# EAGLE design 4Mot_Platine_2022_03 (EAGLE 9.6.2)
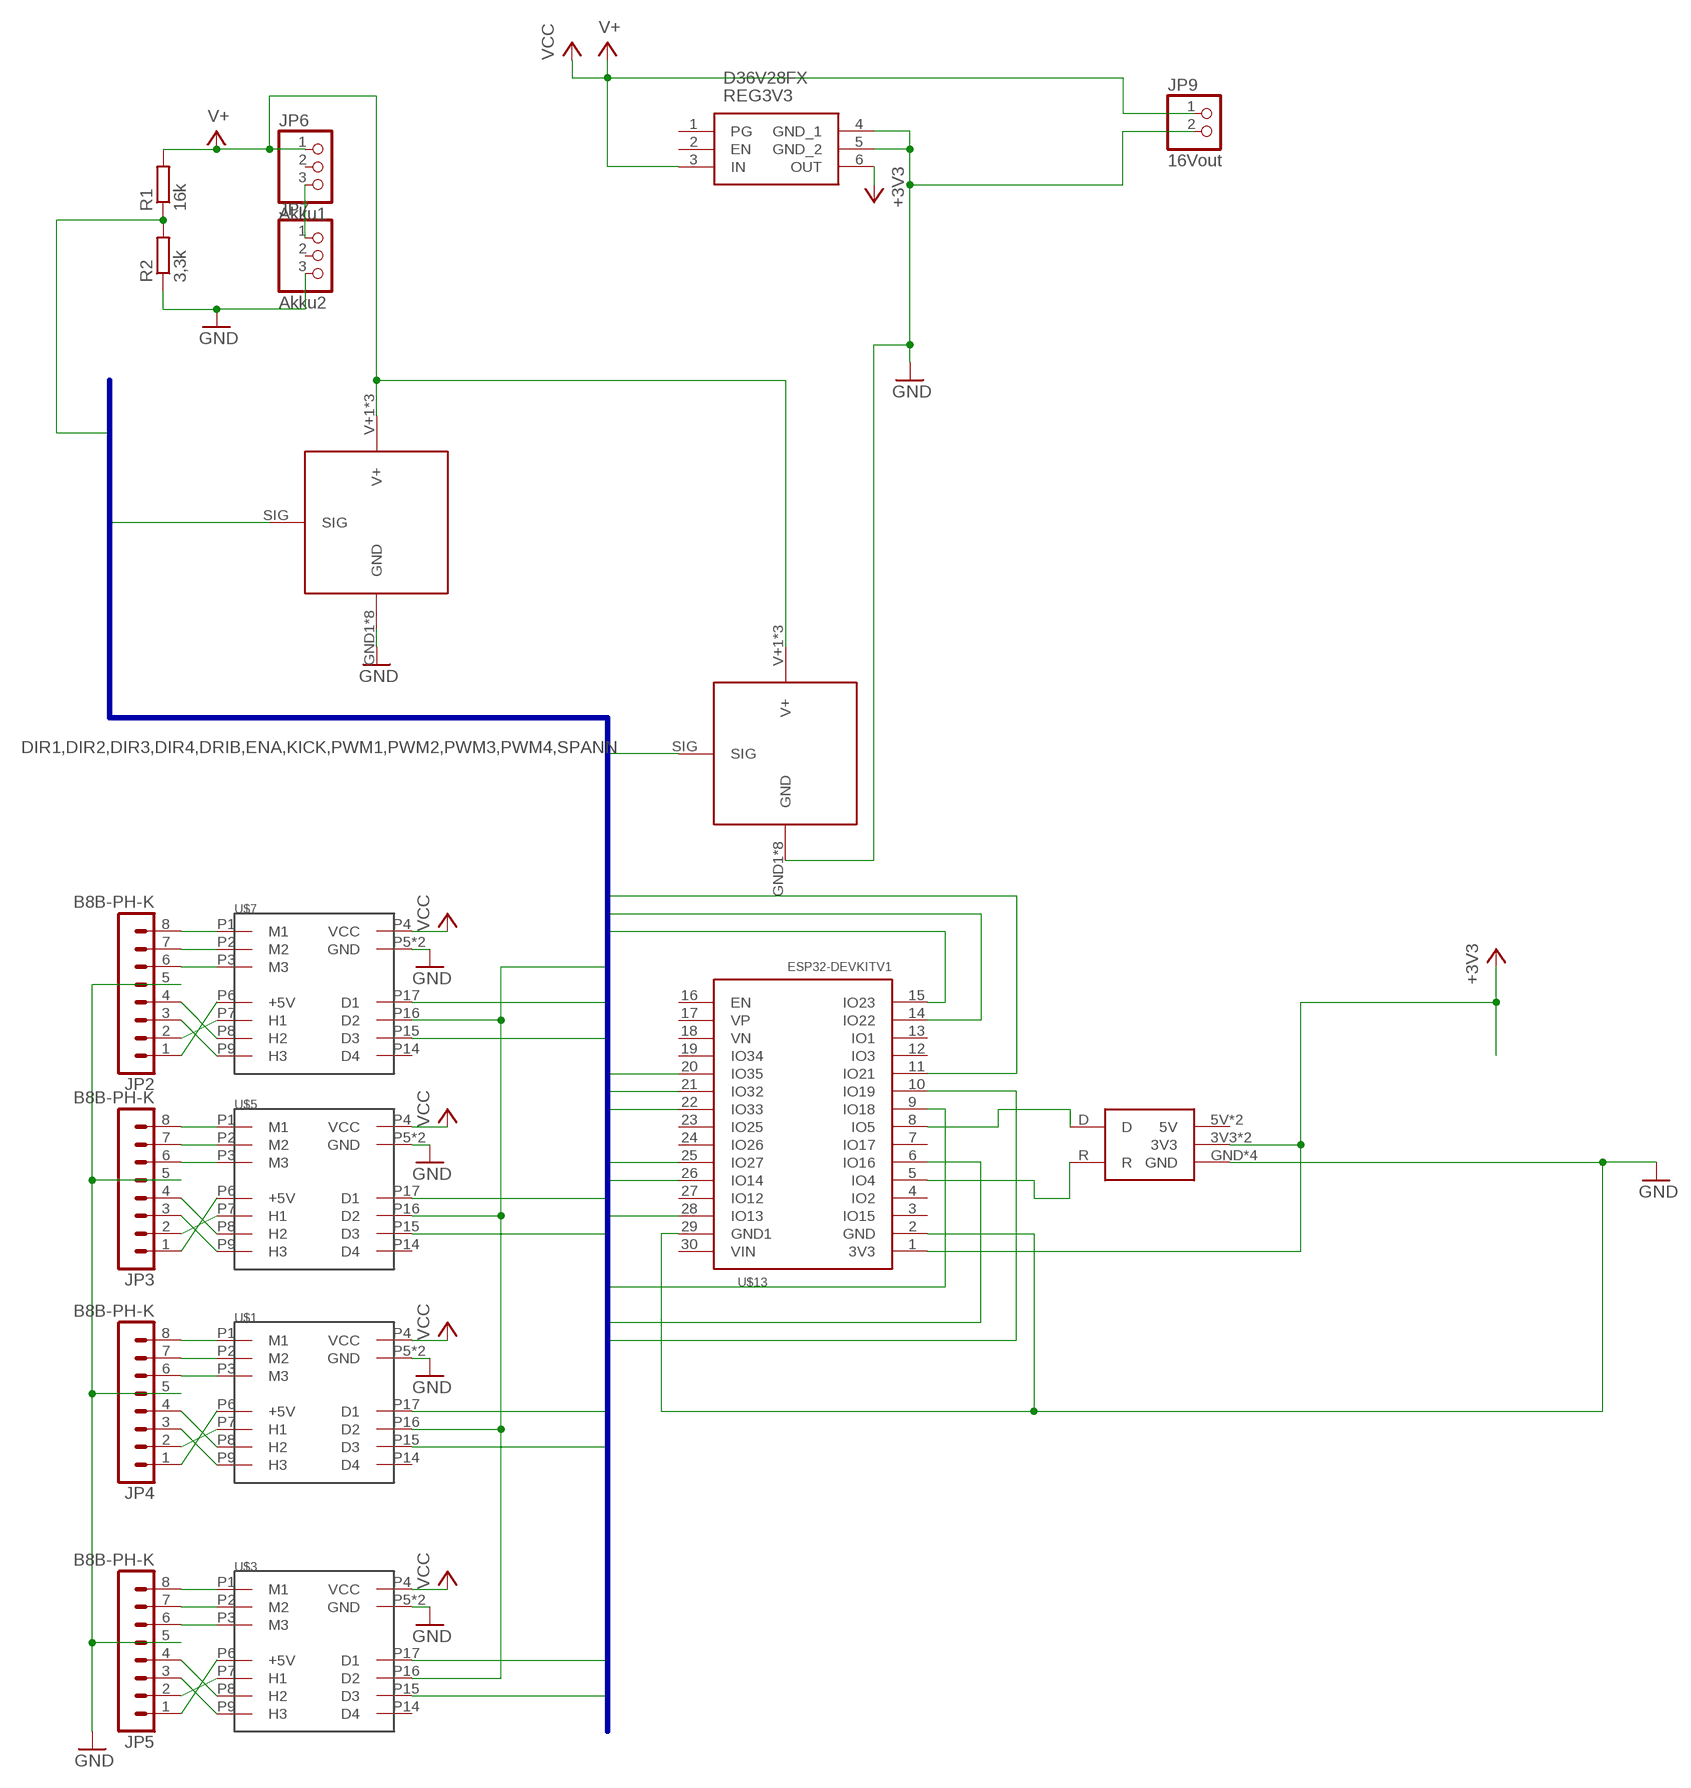
[diagram p0: schematic, sheet 1]

## Parts
JP2  B8B-PH-K  [B8B-PH-K]
JP3  B8B-PH-K  [B8B-PH-K]
JP4  B8B-PH-K  [B8B-PH-K]
JP5  B8B-PH-K  [B8B-PH-K]
JP6  Akku1  PINHD-1X3  [1X03]
JP7  Akku2  PINHD-1X3  [1X03]
JP9  16Vout  PINHD-1X2  [1X02]
R1  16k  R-EU_0204/7  [0204/7]
R2  3,3k  R-EU_0204/7  [0204/7]
REG3V3  D36V28FX  [D36V28FX]
U$1  24/2  [24/2]
U$3  24/2  [24/2]
U$5  24/2  [24/2]
U$7  24/2  [24/2]
U$13  ESP32DEVKITV1  [ESP32-DEVKITV1]
U$14  KICKER  [KICKER]
U$15  KICKER  [KICKER]
U$18  CANBUS  [CANBUS]

## Nets
+3V3: REG3V3.6(OUT) U$13.1(3V3) U$18.3V3 U$18.3V3_1(3V3)
D: U$13.8(IO5) U$18.D
DIR1: U$7.P15(D3) U$13.25(IO27)
DIR2: U$5.P15(D3) U$13.21(IO32)
DIR3: U$1.P15(D3) U$13.11(IO21)
DIR4: U$3.P15(D3) U$13.9(IO18)
DRIB: U$13.28(IO13) U$14.SIG
ENA: U$1.P16(D2) U$3.P16(D2) U$5.P16(D2) U$7.P16(D2) U$13.15(IO23)
GND: JP2.5 JP3.5 JP4.5 JP5.5 JP7.3 JP9.2 R2.1 REG3V3.4(GND_1) REG3V3.5(GND_2) U$1.P5(GND) U$1.P18(GND) U$3.P5(GND) U$3.P18(GND) U$5.P5(GND) U$5.P18(GND) U$7.P5(GND) U$7.P18(GND) U$13.2(GND) U$13.29(GND1) U$14.GND1(GND) U$14.GND2(GND) U$14.GND3(GND) U$14.GND4(GND) U$14.GND5(GND) U$14.GND6(GND) U$14.GND7(GND) U$14.GND8(GND) U$15.GND1(GND) U$15.GND2(GND) U$15.GND3(GND) U$15.GND4(GND) U$15.GND5(GND) U$15.GND6(GND) U$15.GND7(GND) U$15.GND8(GND) U$18.GND U$18.GND_1(GND) U$18.GND_2(GND) U$18.GND_3(GND)
KICK: U$13.6(IO16) U$15.SIG
N$2: JP6.3 JP7.1
N$7: JP2.8 U$7.P1(M1)
N$8: JP2.7 U$7.P2(M2)
N$9: JP2.6 U$7.P3(M3)
N$10: JP3.8 U$5.P1(M1)
N$11: JP3.7 U$5.P2(M2)
N$12: JP3.6 U$5.P3(M3)
N$13: JP4.8 U$1.P1(M1)
N$17: JP4.7 U$1.P2(M2)
N$18: JP4.6 U$1.P3(M3)
N$19: JP5.8 U$3.P1(M1)
N$20: JP5.7 U$3.P2(M2)
N$21: JP5.6 U$3.P3(M3)
N$22: JP2.2 U$7.P7(H1)
N$23: JP2.3 U$7.P9(H3)
N$24: JP2.4 U$7.P8(H2)
N$25: JP3.2 U$5.P7(H1)
N$26: JP3.3 U$5.P9(H3)
N$27: JP3.4 U$5.P8(H2)
N$28: JP4.2 U$1.P7(H1)
N$29: JP4.3 U$1.P9(H3)
N$30: JP4.4 U$1.P8(H2)
N$31: JP5.2 U$3.P7(H1)
N$32: JP5.3 U$3.P9(H3)
N$33: JP5.4 U$3.P8(H2)
N$34: JP2.1 U$7.P6(+5V)
N$35: JP3.1 U$5.P6(+5V)
N$36: JP4.1 U$1.P6(+5V)
N$37: JP5.1 U$3.P6(+5V)
PWM1: U$7.P17(D1) U$13.26(IO14)
PWM2: U$5.P17(D1) U$13.22(IO33)
PWM3: U$1.P17(D1) U$13.14(IO22)
PWM4: U$3.P17(D1) U$13.10(IO19)
R: U$13.5(IO4) U$18.R
SPANN: R1.1 R2.2 U$13.20(IO35)
V+: JP6.1 JP9.1 R1.2 REG3V3.3(IN) U$1.P4(VCC) U$3.P4(VCC) U$5.P4(VCC) U$7.P4(VCC) U$14.V+1(V+) U$14.V+2(V+) U$14.V+3(V+) U$15.V+1(V+) U$15.V+2(V+) U$15.V+3(V+) ; supply symbol labelled VCC
Unconnected: JP6.2 JP7.2 REG3V3.1(PG) REG3V3.2(EN) U$1.P14(D4) U$3.P14(D4) U$5.P14(D4) U$7.P14(D4) U$13.3(IO15) U$13.4(IO2) U$13.7(IO17) U$13.12(IO3) U$13.13(IO1) U$13.16(EN) U$13.17(VP) U$13.18(VN) U$13.19(IO34) U$13.23(IO25) U$13.24(IO26) U$13.27(IO12) U$13.30(VIN) U$18.5V U$18.5V_1(5V)

## Buses
DIR1,DIR2,DIR3,DIR4,DRIB,ENA,KICK,PWM1,PWM2,PWM3,PWM4,SPANN

## Library data of the parts
JP2-JP5 = con-jst-ph:B8B-PH-K: HEADER
JP6 JP7 = pinhead:PINHD-1X3: PIN HEADER
JP9 = pinhead:PINHD-1X2: PIN HEADER
R1 R2 = rcl:R-EU_: RESISTOR, European symbol
REG3V3 = D36V28FX:D36V28FX: 5V, 3.2A Step-Down Voltage Regulator D36V28F5 Source: Datasheet <https://www.pololu.com/product/3782>; DESCRIPTION: 5V, 3.2A Step-Down Voltage Regulator D36V28F5; HEIGHT: 8.77mm; MANUFACTURER_NAME: POLOLU ROBOTICS & ELECTRONICS; MANUFACTURER_PART_NUMBER: D36V28FX
U$1 U$3 U$5 U$7 = maxon-Regler:24/2
U$13 = ESP32-DEVKITV1:ESP32DEVKITV1
U$14 U$15 = kicker:KICKER
U$18 = canbus:CANBUS

## Board
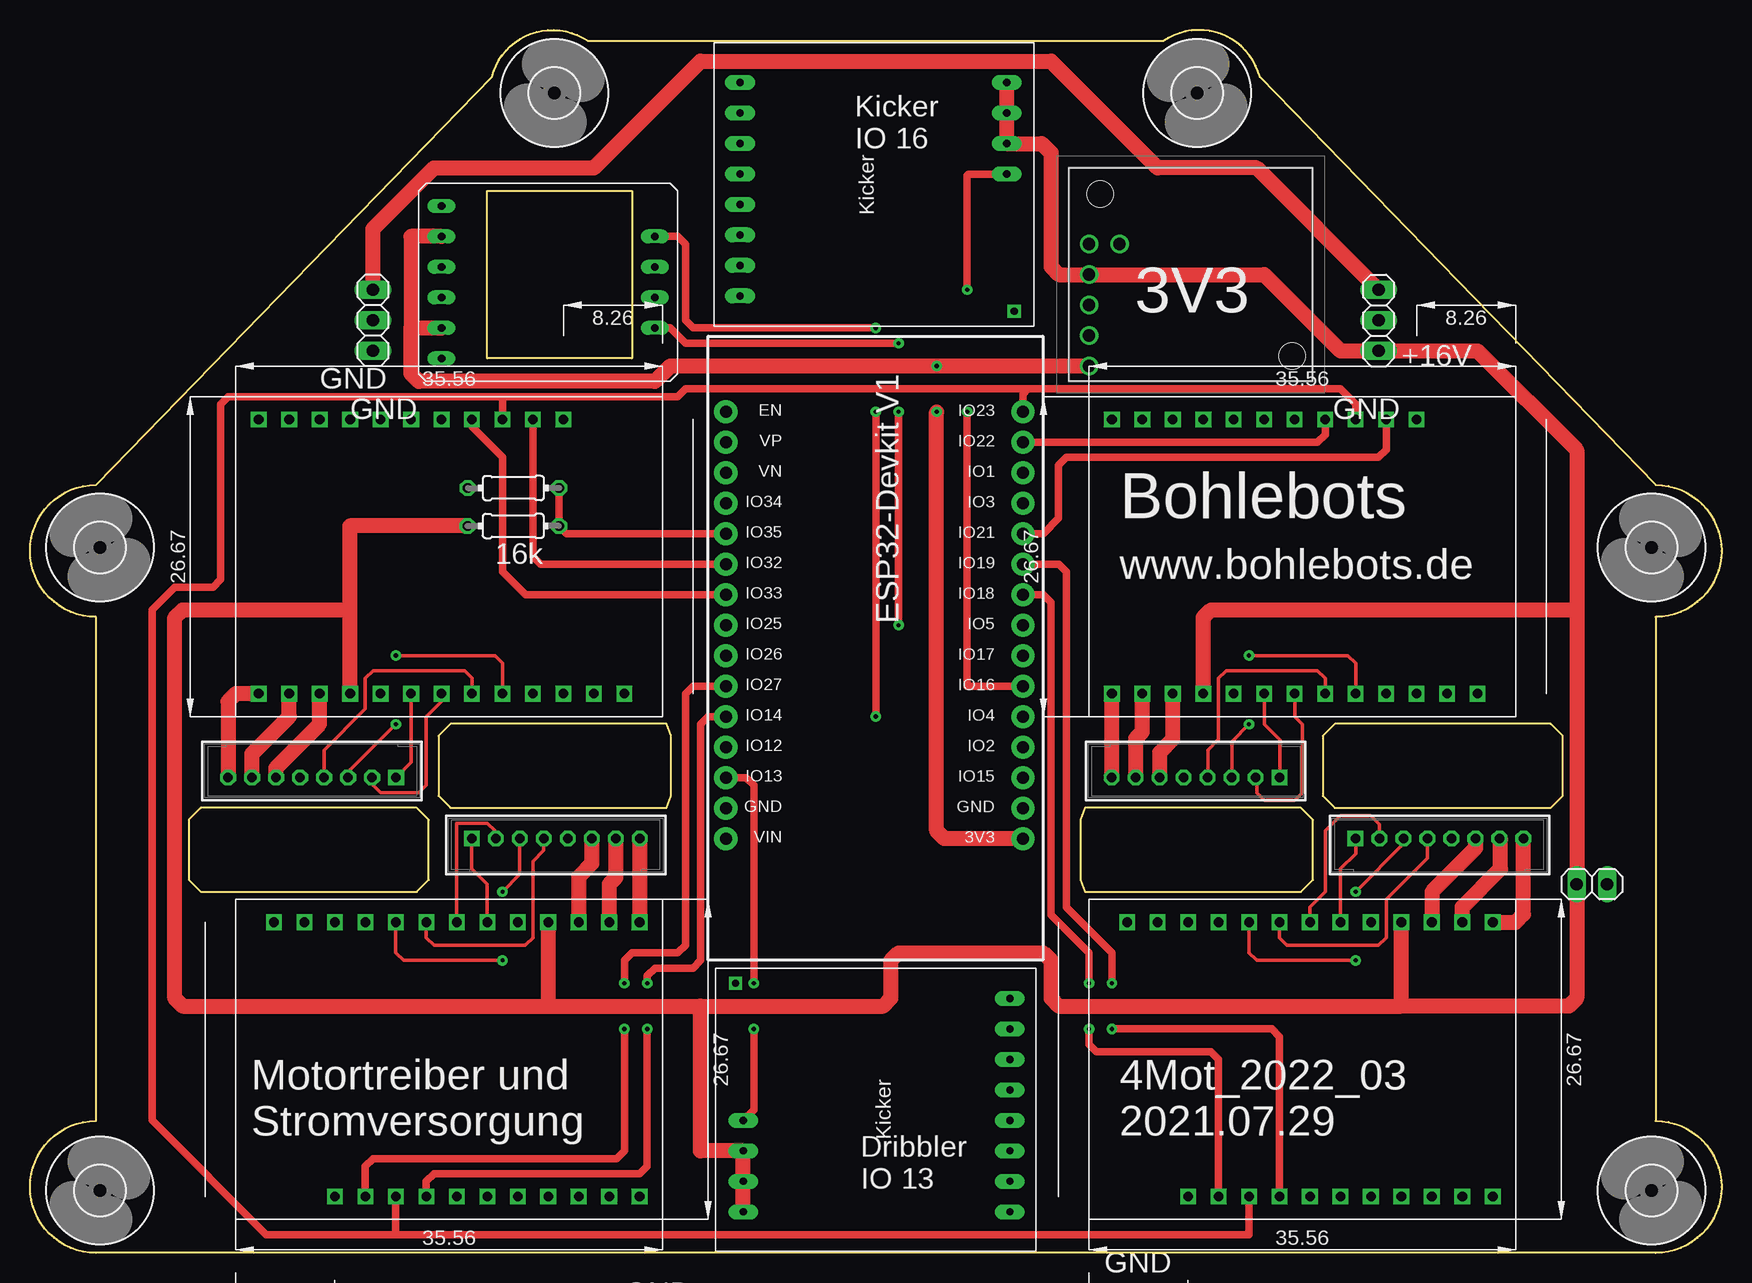
[diagram p1: board, top side]
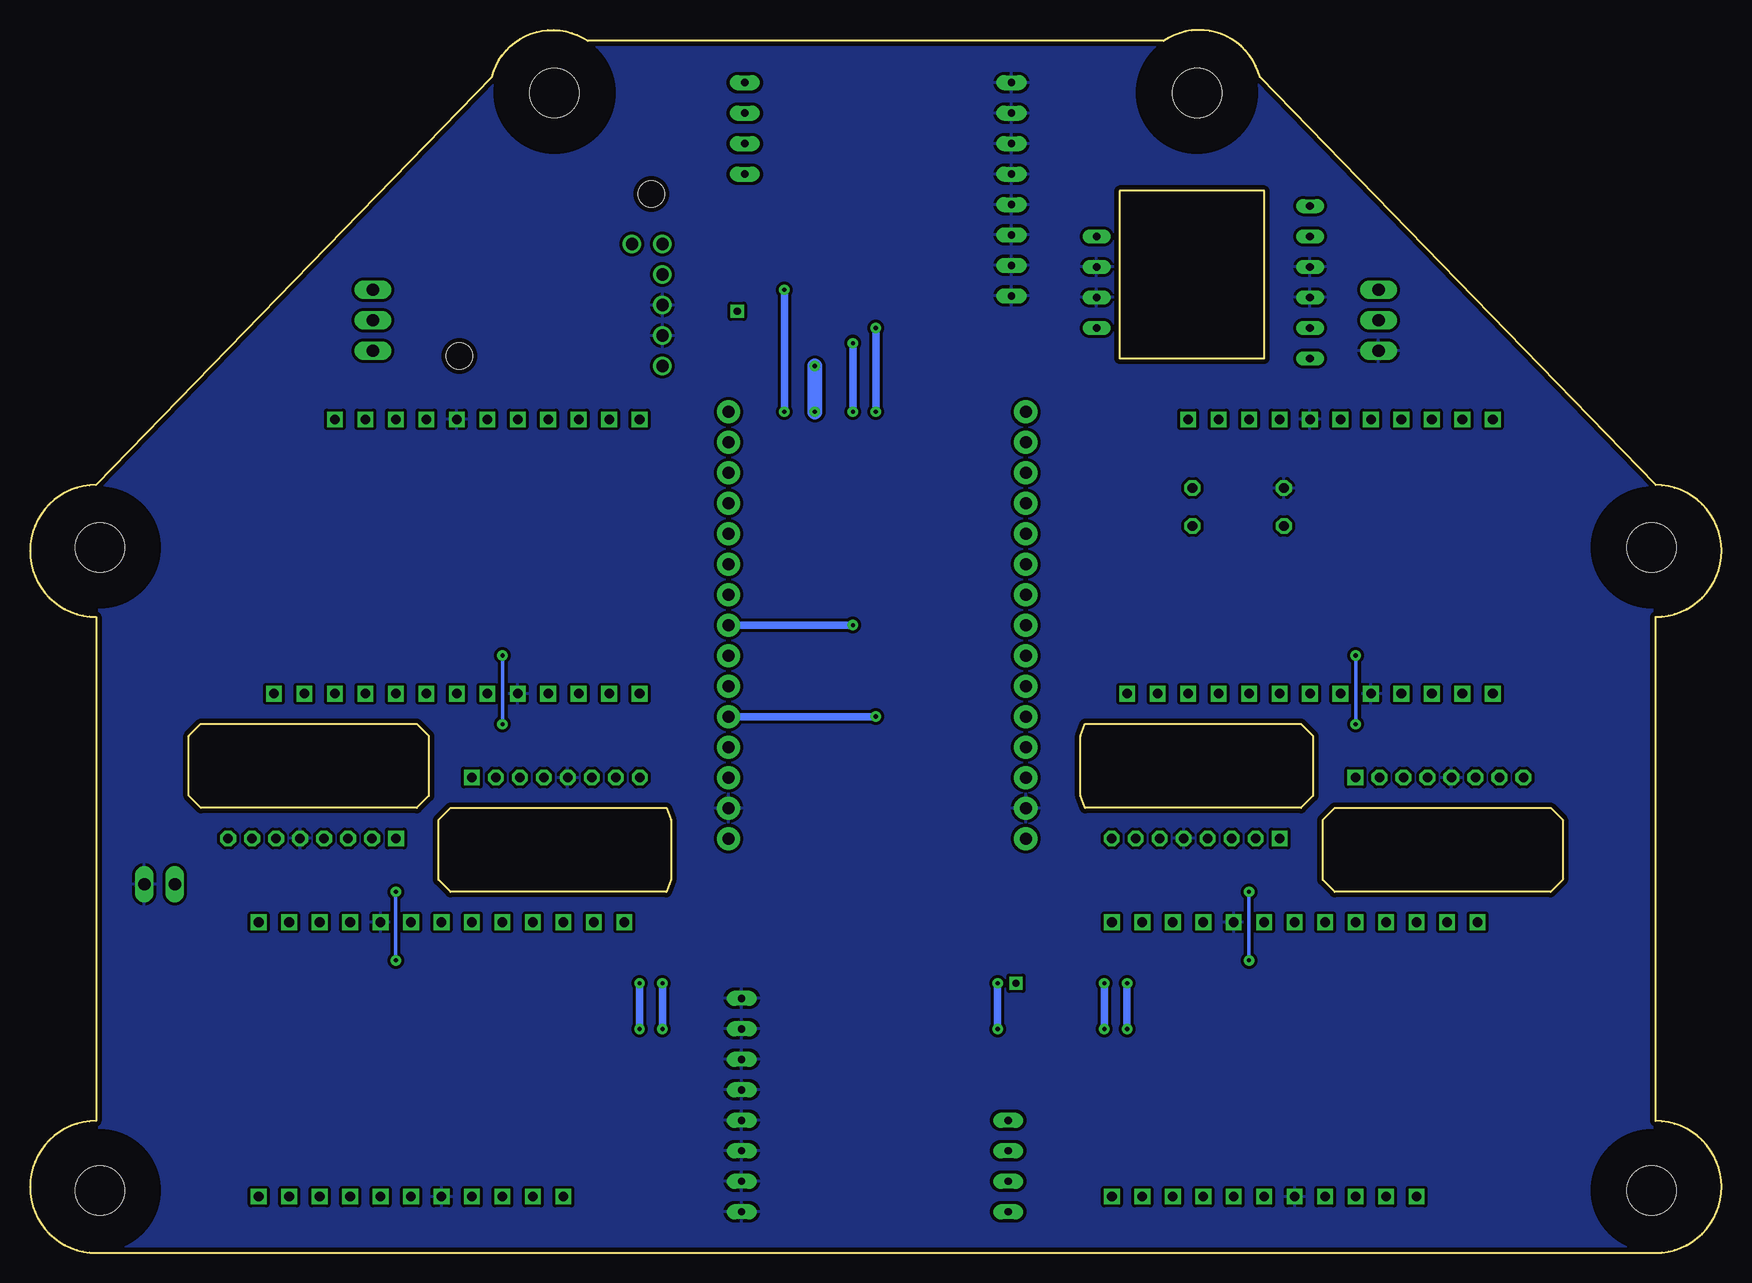
[diagram p2: board, bottom side, seen from below]

Size 141 x 101.91 mm. Coordinates in mm from the lower left corner, seen from the top.
Outline: 5.5,11 5.5,53 arc-180 5.5,64 38.5,98 arc-110 46.5,101 94.5,101 arc-110 102.5,98 135.5,64 arc-180 135.5,53 135.5,11 arc-180 135.5,0 5.5,0 arc-180 5.5,11
Outline: 108.77,37.08 126.77,37.08 127.77,38.08 127.77,43.08 126.77,44.08 108.77,44.08 107.77,43.08 107.77,38.08 108.77,37.08
Outline: 87.94,30.08 105.94,30.08 106.94,31.08 106.94,36.08 105.94,37.08 87.94,37.08 87.58,36.08 87.58,31.08 87.94,30.08
Outline: 35.05,37.08 53.05,37.08 53.42,38.08 53.42,43.08 53.05,44.08 35.05,44.08 34.05,43.08 34.05,38.08 35.05,37.08
Outline: 14.23,30.08 32.23,30.08 33.23,31.08 33.23,36.08 32.23,37.08 14.23,37.08 13.23,36.08 13.23,31.08 14.23,30.08
Outline: 38.12,88.52 50.18,88.52 50.18,74.55 38.12,74.55 38.12,88.52
Copper layers (1*16): Top 0.035mm / dielectric 1.5mm / Bottom 0.035mm
Design rules "default *": minimum track width 10mil, minimum drill 8mil, track to track 10mil, track to pad 10mil, pad to pad 10mil, via to via 10mil, smd to smd 10mil, copper to edge 15mil, drill to drill 8mil, minimum pad ring 10mil, minimum via ring 10mil, stop-mask expansion 0mil, vias tented up to drill 0mil, thermal gap 10mil

### Footprints (pad centres in the part's own frame; a part is rotated, then mirrored left to right if it is on the bottom)
B8B-PH-K = drill 0.813 square: 1 -7,0 | drill 0.813 octagon: 2 -5,0; 3 -3,0; 4 -1,0; 5 1,0; 6 3,0; 7 5,0; 8 7,0
1X03 = drill 1.016 long: 1 -2.54,0; 2 0,0; 3 2.54,0
1X02 = drill 1.016 long: 1 -1.27,0; 2 1.27,0
0204/7 = drill 0.813 octagon: 1 -3.81,0; 2 3.81,0
D36V28FX = drill 1.02 pad 1.53: 1 0,0; 2 0,-2.54; 3 2.54,-2.54; 4 5.08,-2.54; 5 7.62,-2.54; 6 10.16,-2.54 | hole 2.18: -4.17,-1.61; 9.33,14.39
24/2 = drill 0.8 square: P1 15.875,10.795; P2 13.335,10.795; P3 10.795,10.795; P4 8.255,10.795; P5 5.715,10.795; P6 3.175,10.795; P7 0.635,10.795; P8 -1.905,10.795; P9 -4.445,10.795; P10 -6.985,10.795; P11 -9.525,10.795; P12 -12.065,10.795; P13 -14.605,10.795; P14 -9.525,-12.065; P15 -6.985,-12.065; P16 -4.445,-12.065; P17 -1.905,-12.065; P18 0.635,-12.065; P19 3.175,-12.065; P20 5.715,-12.065; P21 8.255,-12.065; P22 10.795,-12.065; P23 13.335,-12.065; P24 15.875,-12.065
4,1 = hole 4.1: 0,0
ESP32-DEVKITV1 = drill 1 pad 1.93: 1 -22.87,-13.54; 2 -20.33,-13.54; 3 -17.79,-13.54; 4 -15.25,-13.54; 5 -12.71,-13.54; 6 -10.17,-13.54; 7 -7.63,-13.54; 8 -5.09,-13.54; 9 -2.55,-13.54; 10 -0.01,-13.54; 11 2.53,-13.54; 12 5.07,-13.54; 13 7.61,-13.54; 14 10.15,-13.54; 15 12.69,-13.54; 16 12.69,11.23; 17 10.15,11.23; 18 7.61,11.23; 19 5.07,11.23; 20 2.53,11.23; 21 -0.01,11.23; 22 -2.55,11.23; 23 -5.09,11.23; 24 -7.63,11.23; 25 -10.17,11.23; 26 -12.71,11.23; 27 -15.25,11.23; 28 -17.79,11.23; 29 -20.33,11.23; 30 -22.87,11.23
KICKER = drill 0.6 pad 1.27 long: GND1 2.54,24.511; GND2 5.08,24.511; GND3 7.62,24.511; GND4 10.16,24.511; GND5 12.7,24.511; GND6 15.24,24.511; GND7 17.78,24.511; GND8 20.32,24.511; SIG 12.7,2.286; V+1 15.24,2.286; V+2 17.78,2.286; V+3 20.32,2.286 | drill 0.6 square: NC 1.27,1.651
CANBUS = drill 0.65 long: 3V3 8.89,3.81; 3V3_1 8.89,-3.81; 5V 8.89,6.35; 5V_1 8.89,-6.35; D -8.89,3.81; GND -8.89,1.27; GND_1 -8.89,-1.27; GND_2 8.89,1.27; GND_3 8.89,-1.27; R -8.89,-3.81

### Placement (x,y rotation side)
JP2  43.83,34.54 0 top
JP3  23.51,39.62 180 top
JP4  97.17,39.62 180 top
JP5  117.49,34.54 0 top
JP6  112.41,77.72 90 top
JP7  28.59,77.72 270 top
JP9  130.19,30.73 0 top
R1  40.28,60.58 180 top
R2  40.3,63.75 0 top
REG3V3  90.82,84.07 270 top
U$1  106.06,57.4 180 top
U$2  [4,1]  5.83,58.79 67.5 top
U$3  106.06,16.76 0 top
U$4  [4,1]  97.29,96.67 67.5 top
U$5  34.94,57.4 180 top
U$6  [4,1]  135.17,5.21 67.5 top
U$7  34.94,16.76 0 top
U$9  [4,1]  43.71,96.67 22.5 top
U$10  [4,1]  135.17,58.79 22.5 top
U$12  [4,1]  5.83,5.21 22.5 top
U$13  69.23,57.4 90 top
U$14  57.16,23.74 270 top
U$15  83.7,77.21 90 top
U$18  43.2,80.9 180 top

### Tracks (layer width: path | path; a pad name or v marks a point on that pad's centre or on a via)
+3V3  (via drill 0.35)
  Top 1.27: REG3V3.6 v75.58,73.91 53.36,73.91 52.09,72.64 32.4,72.64 31.77,73.28 31.77,77.09 | U$13.1 76.22,34.53 75.58,35.17 v75.58,70.1 | 31.77,77.09 U$18.3V3 | U$18.3V3_1 31.77,84.7 31.77,77.09
  Bottom 1.27: v75.58,70.1 v75.58,73.91
D  (via drill 0.35)
  Top 0.61: U$18.D 53.36,77.09 54.62,75.81 v72.41,75.81 | v72.41,52.32 v72.41,70.1
  Bottom 0.61: U$13.8 v72.42,52.31 v72.41,52.32 | v72.41,70.1 v72.41,75.81
DIR1  (via drill 0.35)
  Top 0.61: U$7.P15 27.95,7.23 28.59,7.87 48.91,7.87 49.55,8.5 v49.55,18.66 | U$13.25 55.27,47.23 55.26,47.24 54.62,46.61 54.62,25.65 53.99,25.02 50.18,25.02 49.55,24.38 v49.55,22.48
  Bottom 0.61: v49.55,18.66 v49.55,22.48
DIR2
  Top 0.61: U$5.P15 41.92,58.03 42.57,57.39 U$13.21
DIR3
  Top 0.61: U$13.11 84.46,59.93 85.74,61.21 85.74,65.66 86.38,66.29 112.41,66.29 113.05,66.92 U$1.P15
DIR4  (via drill 0.35)
  Top 0.61: U$13.9 84.48,54.85 85.11,54.23 85.11,28.19 88.28,25.02 v88.28,22.48 | v88.28,18.66 88.28,17.39 88.91,16.76 98.44,16.76 99.08,16.12 U$3.P15
  Bottom 0.61: v88.28,22.48 v88.28,18.66
DRIB  (via drill 0.35)
  Top 0.61: U$13.28 59.7,39.62 60.34,38.98 v60.34,22.48 | v60.34,18.66 60.34,11.93 U$14.SIG
  Bottom 0.61: v60.34,22.48 v60.34,18.66
ENA
  Top 0.61: U$7.P16 30.49,1.52 | 30.49,1.52 101.61,1.52 U$3.P16 | U$1.P16 110.5,70.73 109.23,72 83.2,72 | 83.2,72 54.62,72 53.99,71.37 39.39,71.37 | 39.39,71.37 16.52,71.37 15.89,70.73 15.89,56.13 15.26,55.5 12.08,55.5 10.17,53.59 10.17,11.05 19.7,1.52 30.49,1.52 | U$5.P16 39.39,71.37 | U$13.15 82.77,71.58 83.2,72
GND
  pour Bottom: 39.39,102.48 100.98,102.48 135.27,68.19 135.27,-1.66 6.36,-1.66 5.73,-1.02 5.73,68.83
KICK  (via drill 0.35)
  Top 0.61: U$13.6 78.13,47.23 78.12,47.24 v78.12,70.1 | v78.12,80.26 78.12,89.78 78.25,89.91 U$15.SIG
  Bottom 0.61: v78.12,70.1 v78.12,80.26
N$2
  Top 1.27: JP6.3 102.25,90.42 94,90.42 85.11,99.31 55.89,99.31 47,90.42 33.67,90.42 28.59,85.34 JP7.1
N$7
  Top 1.27: JP2.8 50.83,27.57 U$7.P1
N$8
  Top 1.27: JP2.7 48.83,31.29 48.27,30.73 U$7.P2
N$9
  Top 1.27: JP2.6 46.83,32.46 45.73,31.36 U$7.P3
N$10
  Top 1.27: U$5.P1 17.16,46.61 16.51,45.95 JP3.8
N$11
  Top 1.27: U$5.P2 21.6,44.7 18.51,41.61 JP3.7
N$12
  Top 1.27: JP3.6 20.51,40.43 24.15,44.06 U$5.P3
N$13
  Top 1.27: JP4.8 90.17,46.59 U$1.P1
N$17
  Top 1.27: JP4.7 92.17,42.88 92.72,43.43 U$1.P2
N$18
  Top 1.27: JP4.6 94.17,41.7 95.27,42.8 U$1.P3
N$19
  Top 1.27: U$3.P1 123.84,27.55 124.49,28.2 JP5.8
N$20
  Top 1.27: U$3.P2 119.4,28.82 122.57,32 122.57,34.46 JP5.7
N$21
  Top 1.27: JP5.6 120.49,33.73 116.85,30.09 U$3.P3
N$22
  Top 0.305: JP2.2 38.75,34.62 38.75,35.17 38.12,35.81 35.58,35.81 U$7.P7
N$23  (via drill 0.35)
  Top 0.305: U$7.P9 30.49,25.02 31.13,24.38 v39.39,24.38 | v39.39,30.09 40.83,31.54 JP2.3
  Bottom 0.305: v39.39,24.38 v39.39,30.09
N$24
  Top 0.305: U$7.P8 33.03,26.29 33.67,25.65 41.29,25.65 41.92,26.29 41.92,32.63 42.83,33.54 JP2.4
N$25
  Top 0.305: JP3.2 28.59,39.54 28.59,38.98 29.23,38.35 32.4,38.35 33.03,38.98 33.03,44.7 34.3,45.97 U$5.P7
N$26  (via drill 0.35)
  Top 0.305: U$5.P9 39.39,49.14 38.75,49.78 v30.49,49.78 | v30.49,44.06 26.51,40.08 JP3.3
  Bottom 0.305: v30.49,49.78 v30.49,44.06
N$27
  Top 0.305: U$5.P8 36.84,47.88 36.21,48.51 28.59,48.51 27.95,47.88 27.95,45.34 24.51,41.89 JP3.4
N$28
  Top 0.305: JP4.2 102.25,39.54 102.25,38.35 102.88,37.72 105.42,37.72 106.06,38.35 106.06,44.06 105.42,44.7 U$1.P7
N$29  (via drill 0.35)
  Top 0.305: U$1.P9 110.5,49.14 109.87,49.78 v101.61,49.78 | v101.61,44.06 100.17,42.62 JP4.3
  Bottom 0.305: v101.61,49.78 v101.61,44.06
N$30
  Top 0.305: U$1.P8 107.97,47.88 107.33,48.51 99.71,48.51 99.08,47.88 99.08,42.8 98.17,41.89 JP4.4
N$31
  Top 0.305: JP5.2 112.49,35.73 111.78,36.45 109.23,36.45 107.97,35.17 107.97,30.09 106.69,28.82 U$3.P7
N$32  (via drill 0.35)
  Top 0.305: U$3.P9 101.61,25.02 102.25,24.38 v110.5,24.38 | v110.5,30.09 114.49,34.08 JP5.3
  Bottom 0.305: v110.5,24.38 v110.5,30.09
N$33
  Top 0.305: U$3.P8 104.16,26.29 104.79,25.65 112.41,25.65 113.05,26.29 113.05,29.46 116.49,32.91 JP5.4
N$34
  Top 0.305: JP2.1 36.83,32.02 38.12,30.73 U$7.P6
N$35
  Top 0.305: JP3.1 31.77,40.88 U$5.P6
N$36
  Top 0.305: U$1.P6 102.88,44.06 104.17,42.78 JP4.1
N$37
  Top 0.305: U$3.P6 109.23,32 110.5,33.27 110.5,34.52 JP5.1
PWM1  (via drill 0.35)
  Top 0.61: U$7.P17 33.03,5.96 33.67,6.6 50.81,6.6 51.45,7.23 v51.45,18.66 | v51.45,22.48 51.45,23.11 52.09,23.74 55.26,23.74 55.89,24.38 55.89,44.06 56.53,44.7 U$13.26
  Bottom 0.61: v51.45,18.66 v51.45,22.48
PWM2
  Top 0.61: U$13.22 43.84,54.85 41.3,54.85 39.39,56.77 39.39,66.29 36.84,68.83 U$5.P17
PWM3
  Top 0.61: U$13.14 107.32,67.55 107.97,68.19 U$1.P17
PWM4  (via drill 0.35)
  Top 0.61: U$13.10 85.75,57.39 86.38,56.77 86.38,28.82 90.19,25.02 v90.19,22.48 | v90.19,18.66 103.52,18.66 104.16,18.03 U$3.P17
  Bottom 0.61: v90.19,22.48 v90.19,18.66
R  (via drill 0.35)
  Top 0.61: U$18.R 53.99,84.7 54.62,84.07 54.62,77.72 55.26,77.09 v70.5,77.09 | v70.5,44.7 v70.5,70.1
  Bottom 0.61: U$13.5 v70.5,44.7 | v70.5,70.1 v70.5,77.09
SPANN
  Top 0.61: R2.2 44.09,63.73 R1.1 44.75,59.93 U$13.20
V+
  Top 1.27: 128.92,53.59 JP9.1 128.92,21.2 128.28,20.57 114.31,20.57 | 114.31,20.57 U$3.P4 | U$1.P4 97.81,52.95 98.44,53.59 128.92,53.59 | U$7.P4 43.2,20.57 | 43.2,20.57 12.72,20.57 12.08,21.2 12.08,52.95 12.72,53.59 26.05,53.59 26.69,53.59 | 128.92,53.59 128.92,66.92 120.66,75.18 JP6.1 109.23,75.18 102.88,81.53 REG3V3.3 85.74,81.53 85.11,82.16 85.11,91.69 84.34,92.45 U$15.V+1 U$15.V+2 U$15.V+3 | R1.2 26.69,60.58 26.69,53.59 | U$5.P4 26.69,53.59 | U$14.V+3 U$14.V+2 U$14.V+1 55.89,8.5 55.89,20.57 | 43.2,20.57 55.89,20.57 | 55.89,20.57 71.14,20.57 71.77,21.2 71.77,24.38 72.41,25.02 84.47,25.02 85.11,24.38 85.11,21.2 85.74,20.57 114.31,20.57

### Text on the board
tPlace: Bohlebots | 16k | www.bohlebots.de | Motortreiber und / Stromversorgung | 4Mot_2022_03 / 2021.07.29
tNames: Kicker / IO 16 | 3V3 | +16V | GND | GND | GND | Dribbler / IO 13 | GND | GND